# Altium schematic sheet EDU_High-Speed-Design_CPU_SATA.SchDoc: CPU SATA
size 279 x 215 mm; Date: not used; ApprovedBy: not used; CheckedBy: not used; Author: not used; DrawnBy: not used; Organization: not used; Address4: not used; SheetNumber: 22; SheetTotal: 26; Time: not used; ImagePath: not used; Application_BuildNumber: not used
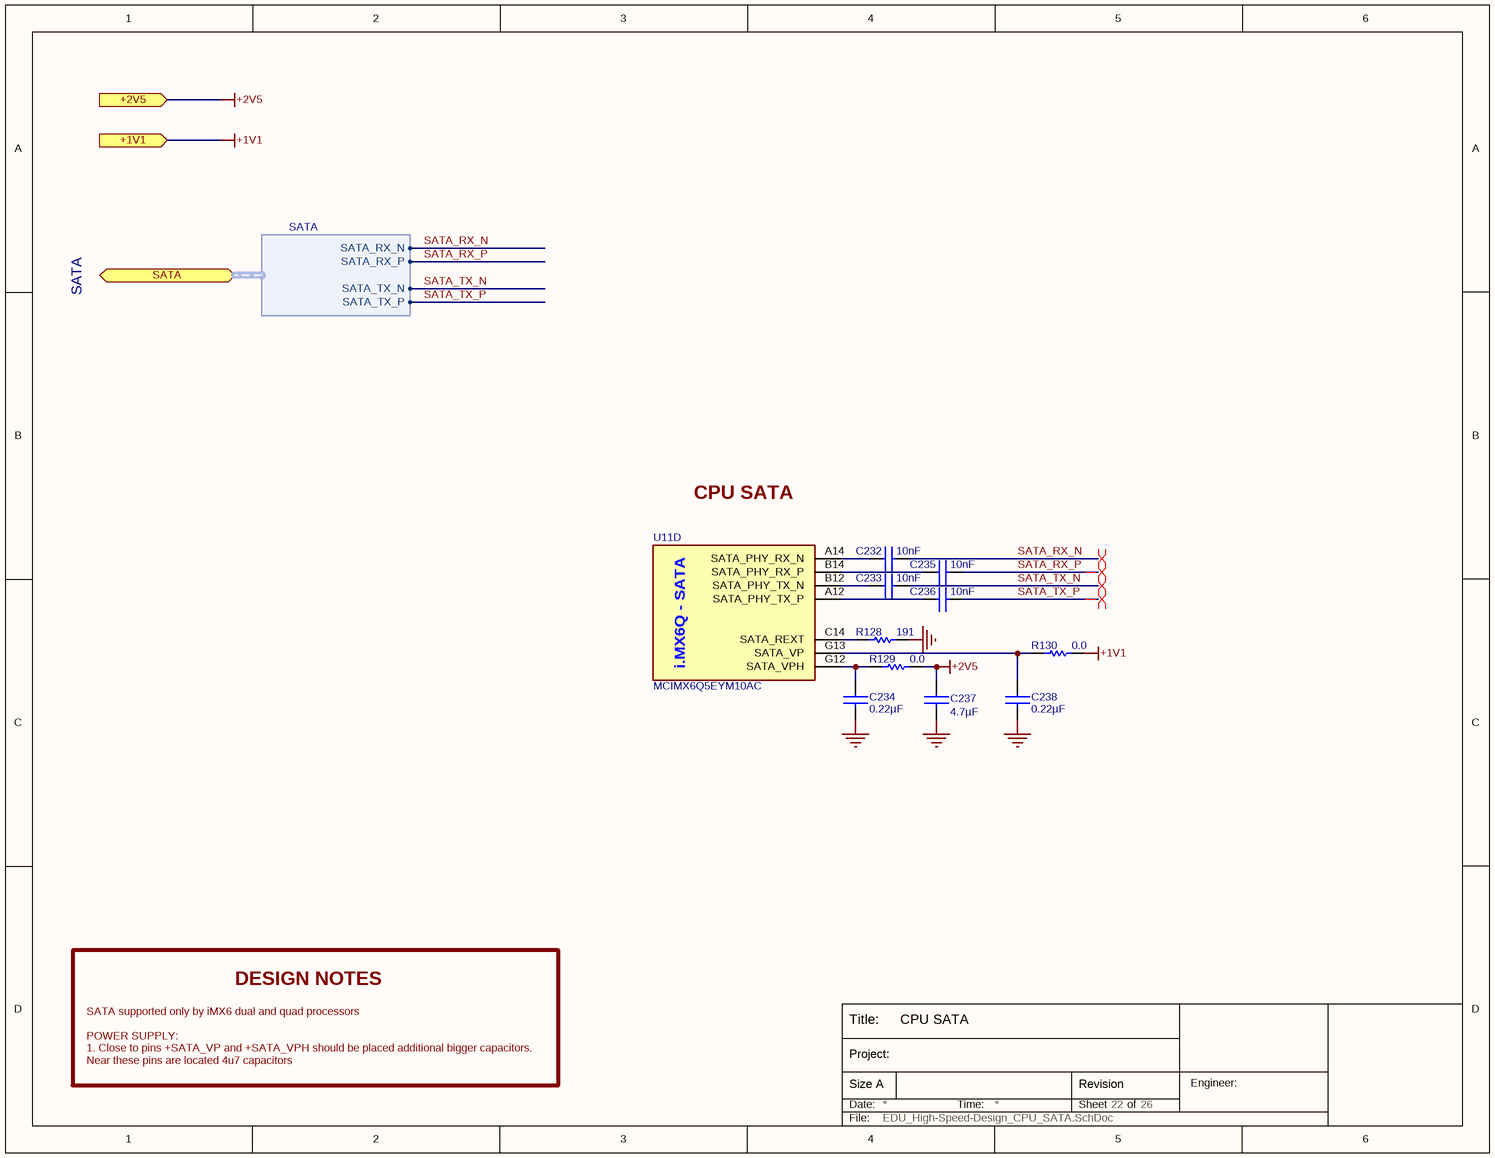
[diagram p0: EDU_High-Speed-Design_CPU_SATA.SchDoc]

## Parts
C232  10nF  [C0402]
C233  10nF  [C0402]
C234  0.22µF  [C0402]
C235  10nF  [C0402]
C236  10nF  [C0402]
C237  4.7µF  [C0402]
C238  0.22µF  [C0402]
R128  191  [R0402]
R129  0.0  [R0402]
R130  0.0  [R0402]
U11  MCIMX6Q5EYM10AC  [MCIMX6Q5EYM10AC]  (part D of 15)

## Ports
+1V1 (in), +2V5 (in), SATA (bidir, harness SATA)

## Harnesses
SATA: SATA_RX_N, SATA_TX_N, SATA_RX_P, SATA_TX_P

## Nets
+1V1: R130.2 ; port +1V1
+2V5: C237.1 R129.2 ; port +2V5
GND: C234.2 C237.2 C238.2 R128.1
SATA_RX_N: C232.2 ; port SATA.SATA_RX_N
SATA_RX_P: C235.2 ; port SATA.SATA_RX_P
SATA_TX_N: C233.2 ; port SATA.SATA_TX_N
SATA_TX_P: C236.2 ; port SATA.SATA_TX_P
NetC232_1: C232.1 U11.A14(SATA_PHY_RX_N)
NetC233_1: C233.1 U11.B12(SATA_PHY_TX_N)
NetC234_1: C234.1 R129.1 U11.G12(SATA_VPH)
NetC235_1: C235.1 U11.B14(SATA_PHY_RX_P)
NetC236_1: C236.1 U11.A12(SATA_PHY_TX_P)
NetC238_1: C238.1 R130.1 U11.G13(SATA_VP)
NetR128_2: R128.2 U11.C14(SATA_REXT)

## Layout directives
differential pair: SATA_RX_N, SATA_RX_P, SATA_TX_N, SATA_TX_P

## Notes on the sheet
- SATA
- CPU SATA
- DESIGN NOTES
- SATA supported only by iMX6 dual and quad processors
  POWER SUPPLY:
  1. Close to pins +SATA_VP and +SATA_VPH should be placed additional bigger capacitors. Near these pins are located 4u7 capacitors
- Title:
- Date:
- Size A
- Project:
- Time:
- Sheet
- Revision
- of
- Engineer:
- File:
- (in symbol MCIMX6Q5EYM10AC, part D) i.MX6Q - SATA

## Library data of the parts
C232 C233 C235 C236 = C1005X7R1H103K: CAP CER 10000PF 50V 10% X7R 0402; Manufacturer: TDK Corporation; Capacitance: 10nF; Manufacturer Part Number: C1005X7R1H103K; Voltage: 50V; Supplier 1: Digi-Key; Supplier Part Number 1: 445-6850-1-ND; ComponentLink1URL: http://www.tdk.co.jp/tefe02/e412_c.pdf; ComponentLink1Description: http://www.tdk.co.jp/tefe02/e412_c.pdf
C234 C238 = C1005X5R1E224M: CAP CER .22UF 25V X5R 20% 0402; Manufacturer 1: TDK Corporation; Capacitance: 0.22µF; Manufacturer Part Number 1: C1005X5R1E224M; Voltage: 25V; Supplier 1: Digi-Key; Supplier Part Number 1: 445-5945-1-ND; ComponentLink1URL: http://www.tdk.co.jp/tefe02/e412_c.pdf; ComponentLink1Description: http://www.tdk.co.jp/tefe02/e412_c.pdf
C237 = C1005X5R1A475M: CAP CER 4.7UF 10V 20% X5R 0402; Manufacturer 1: TDK Corporation; Supplier 1: Digi-Key; Supplier Part Number 1: 445-8023-1-ND; Manufacturer Part Number 1: C1005X5R1A475M; Capacitance: 4.7µF; Voltage: 10V; ComponentLink1URL: http://www.tdk.com/pdf/general_B11.pdf; ComponentLink1Description: http://www.tdk.com/pdf/general_B11.pdf
R128 = CRCW0402191RFKED: RES 191 OHM 1/16W 1% 0402 SMD; Manufacturer: Vishay Dale; Supplier 1: Digi-Key; Manufacturer Part Number: CRCW0402191RFKED; Resistance: 191; ComponentLink1URL: http://www.vishay.com/doc?20035; ComponentLink1Description: http://www.vishay.com/doc?20035; Supplier Part Number 1: 541-191LCT-ND
R129 R130 = RC0402JR-070RL: RES 0.0 OHM 1/16W 0402 SMD; Manufacturer 1: Yageo; Manufacturer Part Number 1: RC0402JR-070RL; Resistance: 0.0; Supplier 1: Digi-Key; Supplier Part Number 1: 311-0.0JRCT-ND; ComponentLink1URL: http://www.yageo.com/documents/recent/PYu-RC0402_51_RoHS_L_6.pdf; ComponentLink1Description: http://www.yageo.com/documents/recent/PYu-RC0402_51_RoHS_L_6.pdf
U11 = MCIMX6Q5EYM10AC: IC MCU 32BIT ARM QUAD 624FCBGA; Manufacturer 1: Freescale Semiconductor; Supplier 1: Digi-Key; Manufacturer Part Number 1: MCIMX6Q5EYM10AC; Supplier Part Number 1: MCIMX6Q5EYM10AC-ND